# Altium schematic sheet Sheet1.SchDoc
size A4
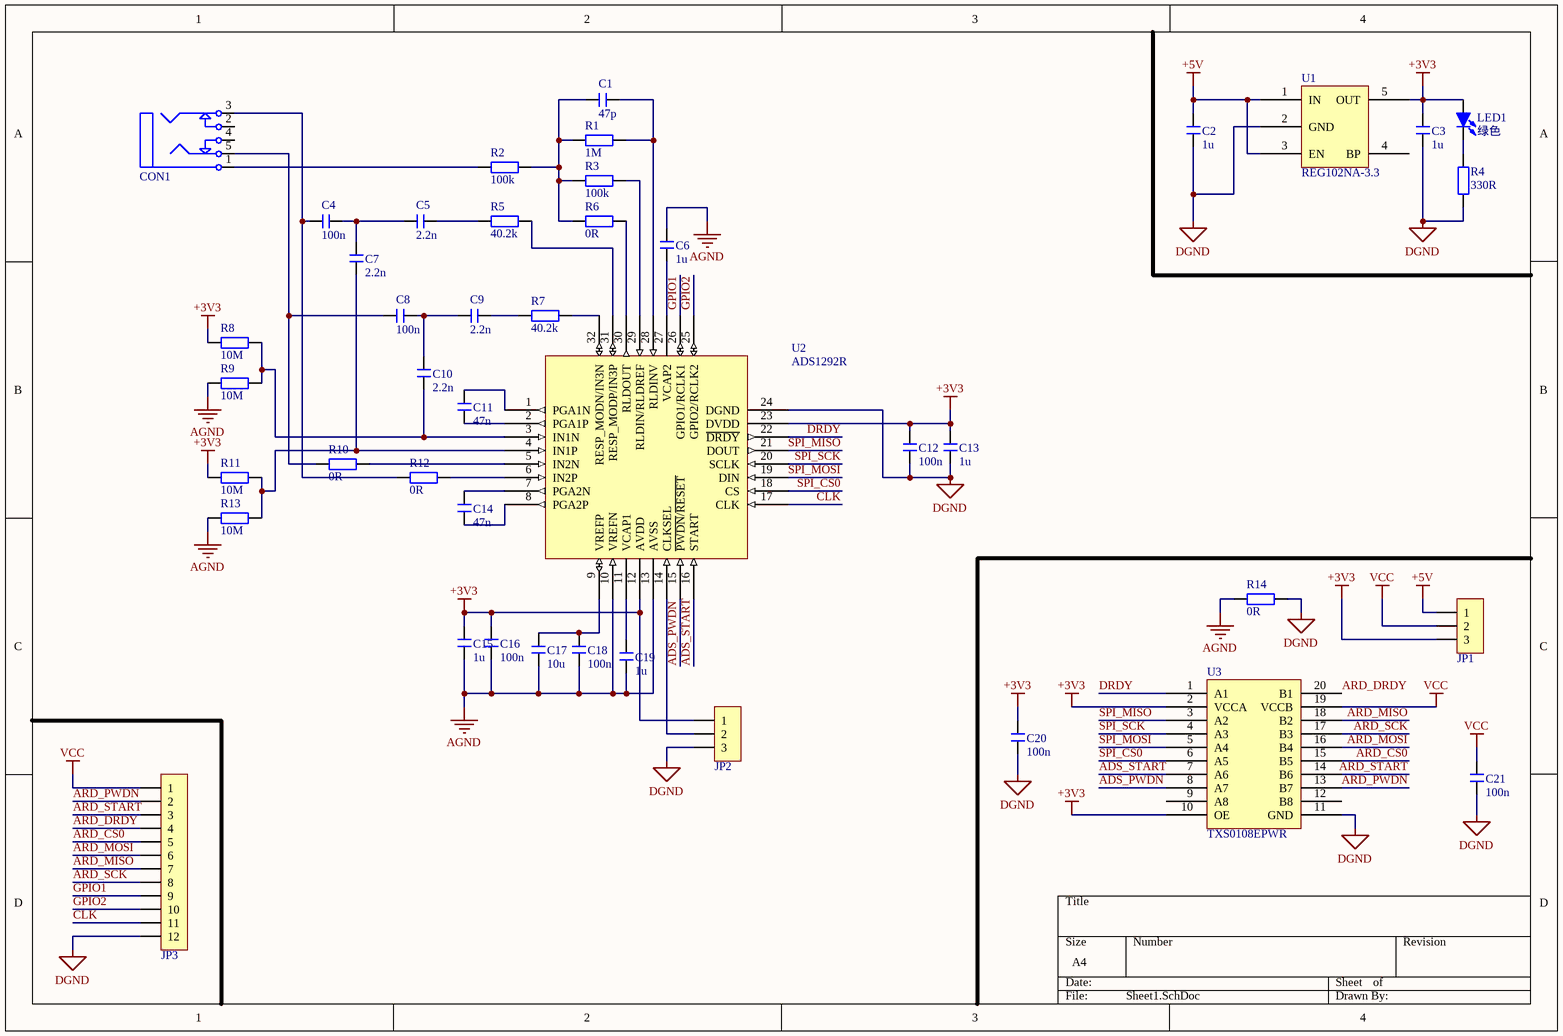
[diagram p0: Sheet1.SchDoc]

## Parts
C1  47p  [C 0805_L]
C2  1u  [C 0805_L]
C3  1u  [C 0805_L]
C4  100n  [C 0805_L]
C5  2.2n  [C 0805_L]
C6  1u  [C 0805_L]
C7  2.2n  [C 0805_L]
C8  100n  [C 0805_L]
C9  2.2n  [C 0805_L]
C10  2.2n  [C 0805_L]
C11  47n  [C 0805_L]
C12  100n  [C 0805_L]
C13  1u  [C 0805_L]
C14  47n  [C 0805_L]
C15  1u  [C 0805_L]
C16  100n  [C 0805_L]
C17  10u  [C 0805_L]
C18  100n  [C 0805_L]
C19  1u  [C 0805_L]
C20  100n  [C 0805_L]
C21  100n  [C 0805_L]
CON1  PJ325_BK  [PJ325_BK]  (value not drawn)
JP1  HDR-1X3  [HDR2.54-LI-3P]  (value not drawn)
JP2  HDR-1X3  [HDR2.54-LI-3P]  (value not drawn)
JP3  HDR-1X12  [HDR2.54-LI-12P]  (value not drawn)
LED1  绿色  [LED 0805G]
R1  1M  [R 0805_L]
R2  100k  [R 0805_L]
R3  100k  [R 0805_L]
R4  330R  [R 0805_L]
R5  40.2k  [R 0805_L]
R6  0R  [R 0805_L]
R7  40.2k  [R 0805_L]
R8  10M  [R 0805_L]
R9  10M  [R 0805_L]
R10  0R  [R 0805_L]
R11  10M  [R 0805_L]
R12  0R  [R 0805_L]
R13  10M  [R 0805_L]
R14  0R  [R 0805_L]
U1  REG102NA-3.3  [REG102NA-3.3]
U2  ADS1292R  [ADS1292R]
U3  TXS0108EPWR  [TXS0108EPWR]

## Nets
+3V3: C3.2 C12.2 C13.1 C15.2 C16.2 C20.2 JP1.3 JP2.1 LED1.1(A) R8.2 R11.2 U1.5(OUT) U2.12(AVDD) U2.23(DVDD) U3.2(VCCA) U3.10(OE)
+5V: C2.2 JP1.1 U1.1(IN) U1.3(EN)
AGND: C6.2 C15.1 C16.1 C17.1 C18.1 C19.1 R9.2 R13.2 R14.1 U2.10(VREFN) U2.13(AVSS)
DGND: C2.1 C3.1 C12.1 C13.2 C20.1 C21.2 JP2.3 JP3.12 R4.1 R14.2 U1.2(GND) U2.24(DGND) U3.11(GND)
VCC: C21.1 JP1.2 JP3.1 U3.19(VCCB)
ADS_PWDN: U2.15(~{PWDN}/~{RESET}) U3.8(A7)
ADS_START: U2.16(START) U3.7(A6)
ARD_CS0: JP3.5 U3.15(B5)
ARD_DRDY: JP3.4 U3.20(B1)
ARD_MISO: JP3.7 U3.18(B2)
ARD_MOSI: JP3.6 U3.16(B4)
ARD_PWDN: JP3.2 U3.13(B7)
ARD_SCK: JP3.8 U3.17(B3)
ARD_START: JP3.3 U3.14(B6)
CLK: JP3.11 U2.17(CLK)
DRDY: U2.22(~{DRDY}) U3.1(A1)
GPIO1: JP3.9 U2.26(GPIO1/RCLK1)
GPIO2: JP3.10 U2.25(GPIO2/RCLK2)
SPI_CS0: U2.18(CS) U3.6(A5)
SPI_MISO: U2.21(DOUT) U3.3(A2)
SPI_MOSI: U2.19(DIN) U3.5(A4)
SPI_SCK: U2.20(SCLK) U3.4(A3)
NetC1_1: C1.1 R1.1 R2.2 R3.1 R6.1
NetC1_2: C1.2 R1.2 U2.28(RLDINV)
NetC4_1: C4.1 CON1.3 R12.1
NetC4_2: C4.2 C5.1 C7.2
NetC5_2: C5.2 R5.1
NetC6_1: C6.1 U2.27(VCAP2)
NetC7_1: C7.1 R11.1 R13.1 U2.4(IN1P)
NetC8_1: C8.1 CON1.5 R10.1
NetC8_2: C8.2 C9.1 C10.2
NetC9_2: C9.2 R7.1
NetC10_1: C10.1 R8.1 R9.1 U2.3(IN1N)
NetC11_1: C11.1 U2.2(PGA1P)
NetC11_2: C11.2 U2.1(PGA1N)
NetC14_1: C14.1 U2.8(PGA2P)
NetC14_2: C14.2 U2.7(PGA2N)
NetC17_2: C17.2 C18.2 U2.9(VREFP)
NetC19_2: C19.2 U2.11(VCAP1)
NetCON1_1: CON1.1 R2.1
NetJP2_2: JP2.2 U2.14(CLKSEL)
NetLED1_2: LED1.2(K) R4.2
NetR3_2: R3.2 U2.29(RLDIN/RLDREF)
NetR5_2: R5.2 U2.31(RESP_MODP/IN3P)
NetR6_2: R6.2 U2.30(RLDOUT)
NetR7_2: R7.2 U2.32(RESP_MODN/IN3N)
NetR10_2: R10.2 U2.5(IN2N)
NetR12_2: R12.2 U2.6(IN2P)

Not connected (* = marked no-connect by the designer): CON1 2 4; U1 4(BP); U3 9(A8) 12(B8)

## Library data of the parts
C1-C21 = C: 无极性贴片电容; 版权归属: 源创客; BOM名称: 无极性贴片电容; 学习资源: www.ooocke.com
CON1 = PJ325: 3.5mm耳机插座; BOM名称: 耳机插座; 版权归属: 源创客; 学习资源: www.ooocke.com
JP1 JP2 = Header 3: 3P接插件; 版权归属: 源创客; BOM名称: 3P接插件; 学习资源: www.ooocke.com
JP3 = Header 12: 12P接插件; 版权归属: 源创客; BOM名称: 12P接插件; 学习资源: www.ooocke.com
LED1 = LED-SMD: 贴片LED; 版权归属: 源创客; BOM名称: 贴片LED; 学习资源: www.ooocke.com
R1-R14 = R: 贴片电阻; 版权归属: 源创客; BOM名称: 贴片电阻; 学习资源: www.ooocke.com